# Altium schematic sheet MCU.SchDoc
size A3; SheetNumber: 2; SheetTotal: 7
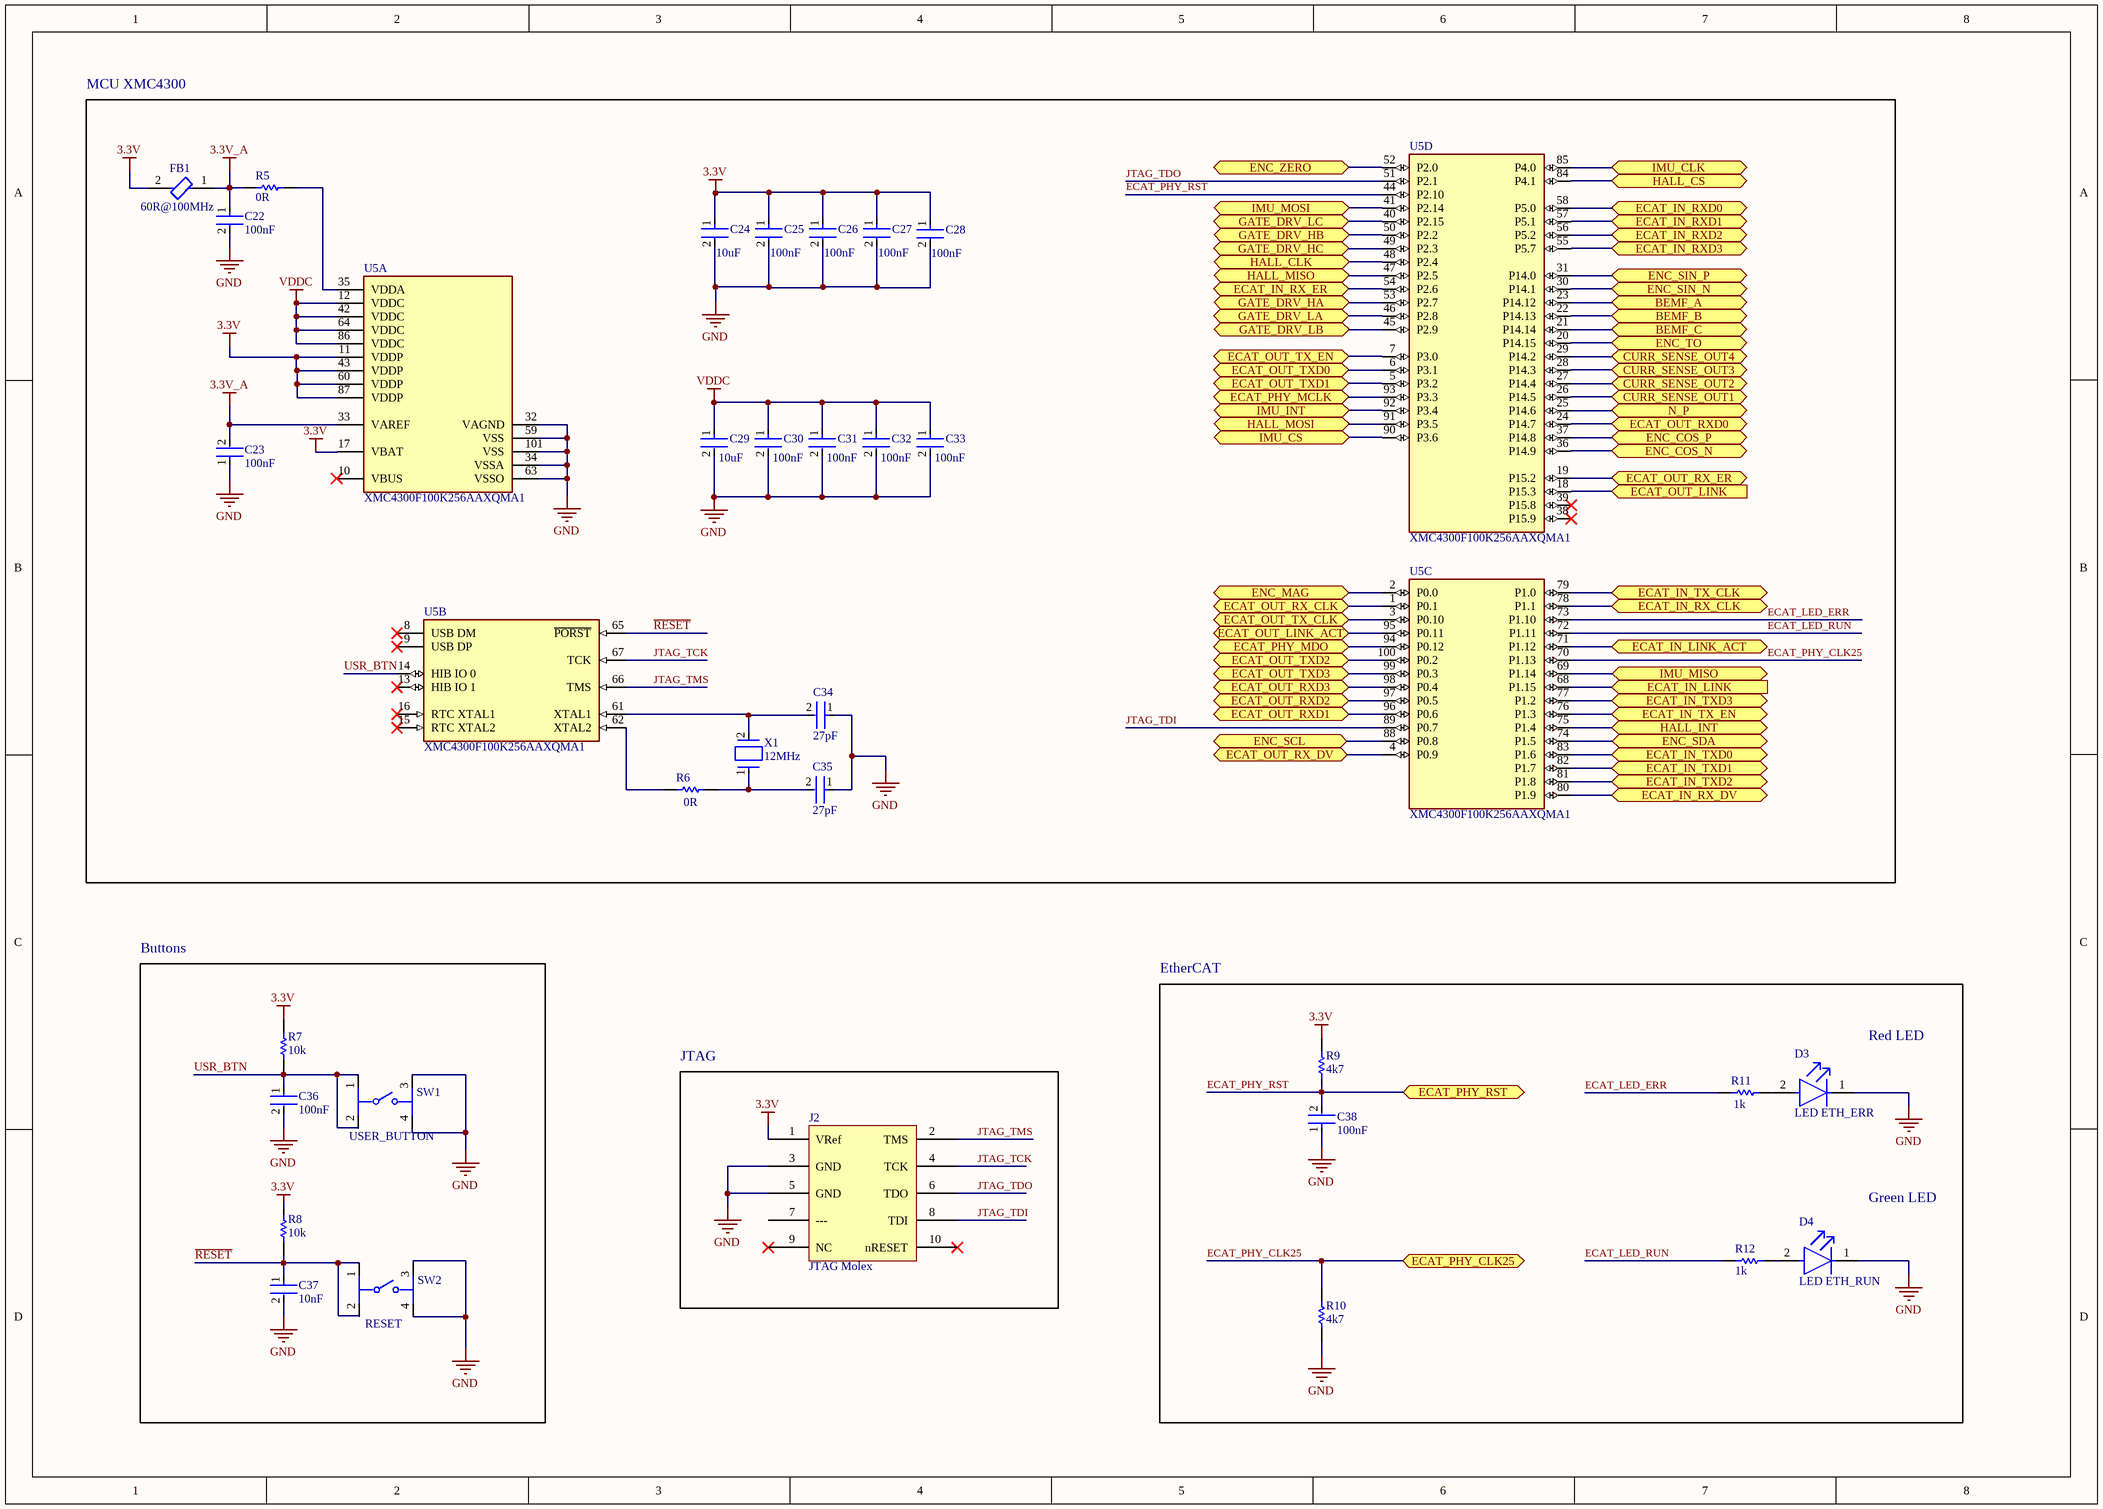
[diagram p0: MCU.SchDoc]

## Parts
C22  100nF  [FP-C0805C-DN-MFG]
C23  100nF  [FP-C0805C-DN-MFG]
C24  10uF  [FP-C0805C-DN-MFG]
C25  100nF  [FP-C0805C-DN-MFG]
C26  100nF  [FP-C0805C-DN-MFG]
C27  100nF  [FP-C0805C-DN-MFG]
C28  100nF  [FP-C0805C-DN-MFG]
C29  10uF  [FP-C0805C-DN-MFG]
C30  100nF  [FP-C0805C-DN-MFG]
C31  100nF  [FP-C0805C-DN-MFG]
C32  100nF  [FP-C0805C-DN-MFG]
C33  100nF  [FP-C0805C-DN-MFG]
C34  27pF  [FP-C0805C-DN-MFG]
C35  27pF  [FP-C0805C-DN-MFG]
C36  100nF  [FP-C0805C-DN-MFG]
C37  10nF  [FP-C0805C-DN-MFG]
C38  100nF  [FP-C0805C-DN-MFG]
D3  LED ETH_ERR  [FP-LTST-C191GKT-MFG]
D4  LED ETH_RUN  [FP-LTST-C191GKT-MFG]
FB1  60R@100MHz  [FP-BLM18-0_15-t0_8-IPC_C]
J2  JTAG Molex  [2X5_JTAG_HEADER]
R5  0R  [RESC2013X50X30LL20T20]
R6  0R  [RESC2013X50X30LL20T20]
R7  10k  [RESC2013X50X30LL20T20]
R8  10k  [RESC2013X50X30LL20T20]
R9  4k7  [RESC2013X50X30LL20T20]
R10  4k7  [RESC2013X50X30LL20T20]
R11  1k  [RESC2013X50X30LL20T20]
R12  1k  [RESC2013X50X30LL20T20]
SW1  USER_BUTTON  [FP-TL3305AF260QG-MFG]
SW2  RESET  [FP-TL3305AF260QG-MFG]
U5  XMC4300F100K256AAXQMA1  [FP-PG-LQFP-100-MFG]  (parts A,B,C,D of 4)
X1  12MHz  [FP-ABM3-MFG]

## Blocks framed on the sheet
MCU XMC4300: C22-C35 FB1 R5 R6 U5 X1
Buttons: C36 C37 R7 R8 SW1 SW2
JTAG: J2

## Ports
BEMF_A (bidir, see MOSFET[4A]), BEMF_B (bidir, see MOSFET[4B]), BEMF_C (bidir, see MOSFET[4B]), CURR_SENSE_OUT1 (bidir, see MOSFET[1C]), CURR_SENSE_OUT2 (bidir, see MOSFET[1C]), CURR_SENSE_OUT3 (bidir, see MOSFET[1C]), CURR_SENSE_OUT4 (bidir, see MOSFET[1C]), ECAT_IN_LINK (in, see ECAT0_(IN)[3D]), ECAT_IN_LINK_ACT (bidir, see ECAT0_(IN)[3D]), ECAT_IN_RX_CLK (bidir, see ECAT0_(IN)[1C]), ECAT_IN_RX_DV (bidir, see ECAT0_(IN)[1C]), ECAT_IN_RX_ER (bidir, see ECAT0_(IN)[1C]), ECAT_IN_RXD0 (bidir, see ECAT0_(IN)[4C]), ECAT_IN_RXD1 (bidir, see ECAT0_(IN)[4C]), ECAT_IN_RXD2 (bidir, see ECAT0_(IN)[4C]), ECAT_IN_RXD3 (bidir, see ECAT0_(IN)[4C]), ECAT_IN_TX_CLK (bidir, see ECAT0_(IN)[1B]), ECAT_IN_TX_EN (bidir, see ECAT0_(IN)[1B]), ECAT_IN_TXD0 (bidir, see ECAT0_(IN)[1B]), ECAT_IN_TXD1 (bidir, see ECAT0_(IN)[1B]), ECAT_IN_TXD2 (bidir, see ECAT0_(IN)[1C]), ECAT_IN_TXD3 (bidir, see ECAT0_(IN)[1C]), ECAT_OUT_LINK (in, see ECAT1_(OUT)[4D]), ECAT_OUT_LINK_ACT (bidir, see ECAT1_(OUT)[4D]), ECAT_OUT_RX_CLK (bidir, see ECAT1_(OUT)[1C]), ECAT_OUT_RX_DV (bidir, see ECAT1_(OUT)[1C]), ECAT_OUT_RX_ER (bidir, see ECAT1_(OUT)[1C]), ECAT_OUT_RXD0 (bidir, see ECAT1_(OUT)[4C]), ECAT_OUT_RXD1 (bidir, see ECAT1_(OUT)[4C]), ECAT_OUT_RXD2 (bidir, see ECAT1_(OUT)[4C]), ECAT_OUT_RXD3 (bidir, see ECAT1_(OUT)[4C]), ECAT_OUT_TX_CLK (bidir, see ECAT1_(OUT)[1B]), ECAT_OUT_TX_EN (bidir, see ECAT1_(OUT)[1C]), ECAT_OUT_TXD0 (bidir, see ECAT1_(OUT)[1C]), ECAT_OUT_TXD1 (bidir, see ECAT1_(OUT)[1C]), ECAT_OUT_TXD2 (bidir, see ECAT1_(OUT)[1C]), ECAT_OUT_TXD3 (bidir, see ECAT1_(OUT)[1C]), ECAT_PHY_CLK25 (bidir, see ECAT0_(IN)[4B], ECAT1_(OUT)[4B]), ECAT_PHY_MCLK (bidir, see ECAT0_(IN)[1C], ECAT1_(OUT)[1C]), ECAT_PHY_MDO (bidir, see ECAT0_(IN)[1C], ECAT1_(OUT)[1C]), ECAT_PHY_RST (bidir, see ECAT0_(IN)[1C], ECAT1_(OUT)[1C]), ENC_COS_N (bidir, see Encoder[3B]), ENC_COS_P (bidir, see Encoder[3C]), ENC_MAG (bidir, see Encoder[1A]), ENC_SCL (bidir, see Encoder[2A]), ENC_SDA (bidir, see Encoder[2A]), ENC_SIN_N (bidir, see Encoder[3B]), ENC_SIN_P (bidir, see Encoder[3B]), ENC_TO (bidir, see Encoder[2C]), ENC_ZERO (bidir, see Encoder[1A]), GATE_DRV_HA (bidir, see MOSFET[1A]), GATE_DRV_HB (bidir, see MOSFET[1A]), GATE_DRV_HC (bidir, see MOSFET[1A]), GATE_DRV_LA (bidir, see MOSFET[1B]), GATE_DRV_LB (bidir, see MOSFET[1B]), GATE_DRV_LC (bidir, see MOSFET[1B]), HALL_CLK (bidir, see Encoder[3A]), HALL_CS (bidir, see Encoder[3A]), HALL_INT (bidir, see Encoder[3B]), HALL_MISO (bidir, see Encoder[3A]), HALL_MOSI (bidir, see Encoder[3A]), IMU_CLK (bidir, see IMU[2B]), IMU_CS (bidir, see IMU[2B]), IMU_INT (bidir, see IMU[2B]), IMU_MISO (bidir, see IMU[2B]), IMU_MOSI (bidir, see IMU[2B]), N_P (bidir, see MOSFET[4C])

## Nets
3.3V: C24.1 C25.1 C26.1 C27.1 C28.1 FB1.2 J2.1(VRef) R7.1 R8.1 R9.2 U5.11(VDDP) U5.17(VBAT) U5.43(VDDP) U5.60(VDDP) U5.87(VDDP)
3.3V_A: C22.1 C23.2 FB1.1 R5.1 U5.33(VAREF)
GND: C22.2 C23.1 C24.2 C25.2 C26.2 C27.2 C28.2 C29.2 C30.2 C31.2 C32.2 C33.2 C34.1 C35.1 C36.2 C37.2 C38.1 D3.1(C) D4.1(C) J2.3(GND) J2.5(GND) R10.1 SW1.3 SW1.4 SW2.3 SW2.4 U5.32(VAGND) U5.34(VSSA) U5.59(VSS) U5.63(VSSO) U5.101(VSS)
VDDC: C29.1 C30.1 C31.1 C32.1 C33.1 U5.12(VDDC) U5.42(VDDC) U5.64(VDDC) U5.86(VDDC)
BEMF_A: U5.23(P14.12) ; port BEMF_A
BEMF_B: U5.22(P14.13) ; port BEMF_B
BEMF_C: U5.21(P14.14) ; port BEMF_C
CURR_SENSE_OUT1: U5.26(P14.5) ; port CURR_SENSE_OUT1
CURR_SENSE_OUT2: U5.27(P14.4) ; port CURR_SENSE_OUT2
CURR_SENSE_OUT3: U5.28(P14.3) ; port CURR_SENSE_OUT3
CURR_SENSE_OUT4: U5.29(P14.2) ; port CURR_SENSE_OUT4
ECAT_IN_LINK: U5.68(P1.15) ; port ECAT_IN_LINK
ECAT_IN_LINK_ACT: U5.71(P1.12) ; port ECAT_IN_LINK_ACT
ECAT_IN_RX_CLK: U5.78(P1.1) ; port ECAT_IN_RX_CLK
ECAT_IN_RX_DV: U5.80(P1.9) ; port ECAT_IN_RX_DV
ECAT_IN_RX_ER: U5.54(P2.6) ; port ECAT_IN_RX_ER
ECAT_IN_RXD0: U5.58(P5.0) ; port ECAT_IN_RXD0
ECAT_IN_RXD1: U5.57(P5.1) ; port ECAT_IN_RXD1
ECAT_IN_RXD2: U5.56(P5.2) ; port ECAT_IN_RXD2
ECAT_IN_RXD3: U5.55(P5.7) ; port ECAT_IN_RXD3
ECAT_IN_TX_CLK: U5.79(P1.0) ; port ECAT_IN_TX_CLK
ECAT_IN_TX_EN: U5.76(P1.3) ; port ECAT_IN_TX_EN
ECAT_IN_TXD0: U5.83(P1.6) ; port ECAT_IN_TXD0
ECAT_IN_TXD1: U5.82(P1.7) ; port ECAT_IN_TXD1
ECAT_IN_TXD2: U5.81(P1.8) ; port ECAT_IN_TXD2
ECAT_IN_TXD3: U5.77(P1.2) ; port ECAT_IN_TXD3
ECAT_LED_ERR: R11.1 U5.73(P1.10)
ECAT_LED_RUN: R12.1 U5.72(P1.11)
ECAT_OUT_LINK: U5.18(P15.3) ; port ECAT_OUT_LINK
ECAT_OUT_LINK_ACT: U5.95(P0.11) ; port ECAT_OUT_LINK_ACT
ECAT_OUT_RX_CLK: U5.1(P0.1) ; port ECAT_OUT_RX_CLK
ECAT_OUT_RX_DV: U5.4(P0.9) ; port ECAT_OUT_RX_DV
ECAT_OUT_RX_ER: U5.19(P15.2) ; port ECAT_OUT_RX_ER
ECAT_OUT_RXD0: U5.24(P14.7) ; port ECAT_OUT_RXD0
ECAT_OUT_RXD1: U5.96(P0.6) ; port ECAT_OUT_RXD1
ECAT_OUT_RXD2: U5.97(P0.5) ; port ECAT_OUT_RXD2
ECAT_OUT_RXD3: U5.98(P0.4) ; port ECAT_OUT_RXD3
ECAT_OUT_TX_CLK: U5.3(P0.10) ; port ECAT_OUT_TX_CLK
ECAT_OUT_TX_EN: U5.7(P3.0) ; port ECAT_OUT_TX_EN
ECAT_OUT_TXD0: U5.6(P3.1) ; port ECAT_OUT_TXD0
ECAT_OUT_TXD1: U5.5(P3.2) ; port ECAT_OUT_TXD1
ECAT_OUT_TXD2: U5.100(P0.2) ; port ECAT_OUT_TXD2
ECAT_OUT_TXD3: U5.99(P0.3) ; port ECAT_OUT_TXD3
ECAT_PHY_CLK25: R10.2 U5.70(P1.13) ; port ECAT_PHY_CLK25
ECAT_PHY_MCLK: U5.93(P3.3) ; port ECAT_PHY_MCLK
ECAT_PHY_MDO: U5.94(P0.12) ; port ECAT_PHY_MDO
ECAT_PHY_RST: C38.2 R9.1 U5.44(P2.10) ; port ECAT_PHY_RST
ENC_COS_N: U5.36(P14.9) ; port ENC_COS_N
ENC_COS_P: U5.37(P14.8) ; port ENC_COS_P
ENC_MAG: U5.2(P0.0) ; port ENC_MAG
ENC_SCL: U5.88(P0.8) ; port ENC_SCL
ENC_SDA: U5.74(P1.5) ; port ENC_SDA
ENC_SIN_N: U5.30(P14.1) ; port ENC_SIN_N
ENC_SIN_P: U5.31(P14.0) ; port ENC_SIN_P
ENC_TO: U5.20(P14.15) ; port ENC_TO
ENC_ZERO: U5.52(P2.0) ; port ENC_ZERO
GATE_DRV_HA: U5.53(P2.7) ; port GATE_DRV_HA
GATE_DRV_HB: U5.50(P2.2) ; port GATE_DRV_HB
GATE_DRV_HC: U5.49(P2.3) ; port GATE_DRV_HC
GATE_DRV_LA: U5.46(P2.8) ; port GATE_DRV_LA
GATE_DRV_LB: U5.45(P2.9) ; port GATE_DRV_LB
GATE_DRV_LC: U5.40(P2.15) ; port GATE_DRV_LC
HALL_CLK: U5.48(P2.4) ; port HALL_CLK
HALL_CS: U5.84(P4.1) ; port HALL_CS
HALL_INT: U5.75(P1.4) ; port HALL_INT
HALL_MISO: U5.47(P2.5) ; port HALL_MISO
HALL_MOSI: U5.91(P3.5) ; port HALL_MOSI
IMU_CLK: U5.85(P4.0) ; port IMU_CLK
IMU_CS: U5.90(P3.6) ; port IMU_CS
IMU_INT: U5.92(P3.4) ; port IMU_INT
IMU_MISO: U5.69(P1.14) ; port IMU_MISO
IMU_MOSI: U5.41(P2.14) ; port IMU_MOSI
JTAG_TCK: J2.4(TCK) U5.67(TCK)
JTAG_TDI: J2.8(TDI) U5.89(P0.7)
JTAG_TDO: J2.6(TDO) U5.51(P2.1)
JTAG_TMS: J2.2(TMS) U5.66(TMS)
N_P: U5.25(P14.6) ; port N_P
~{RESET}: C37.1 R8.2 SW2.1 SW2.2 U5.65(~{PORST})
USR_BTN: C36.1 R7.2 SW1.1 SW1.2 U5.14(HIB_IO_0)
NetC34_2: C34.2 U5.61(XTAL1) X1.2
NetC35_2: C35.2 R6.2 X1.1
NetD3_2: D3.2(A) R11.2
NetD4_2: D4.2(A) R12.2
NetR5_2: R5.2 U5.35(VDDA)
NetR6_1: R6.1 U5.62(XTAL2)

Not connected (* = marked no-connect by the designer): J2 7(---) 9(NC)* 10(nRESET)*; U5 8(USB_DM)* 9(USB_DP)* 10(VBUS)* 13(HIB_IO_1)* 15(RTC_XTAL2)* 16(RTC_XTAL1)* 38(P15.9)* 39(P15.8)*

## Notes on the sheet
- EtherCAT
- Red LED
- Green LED

## Library data of the parts
C22-C38 = CMP-2007-00279-2: CAP CER 0.1UF 50V X7R 0805; Manufacturer Part Number: C0805C104K5RACTU; Manufacturer: KEMET; Value: 0.10 μF; Tolerance: 0.1; Temperature Coefficient: 30ppm/°C; Material: Ceramic; Device Class L2: Capacitors; Temperature Range Low: -55°C; Voltage Rating: 50 V; Digikey Description: CAP CER 0.1UF 50V X7R 0805; Category: Cap; ComponentLink2Description: Datasheet; Octopart: https://octopart.com/c0805c104k5ractu-kemet-143926; RoHS: TRUE; ComponentLink2URL: https://content.kemet.com/datasheets/KEM_C1003_C0G_SMD.pdf; Temperature Characteristic: X7R; Temperature: -55°C to +125°C; Height: 0.88mm; Temperature Range High: +125°C; Device Class L1: Passive Components; Automotive: No; Lead Free: Yes; Ipc Land Pattern Name: CAPC200125X78; Device Class L3: Ceramic Capacitors; Mouser Description: Cap Ceramic 0.1uF 50V X7R 10% SMD 2.0 x 1.2 mm 125 C Paper T/R; Capacitance: 0.10 μF; Package: C0805C-DN
D3 D4 = CMP-22017-000029-1: KPHD-1608LVCGCK; Power Dissipation: 100mW; Lens Color: Colorless; Number of Elements: 1; Dominant Wavelength: 569nm; Illumination Color: Green; Lens Style: Clear; Forward Voltage: 2.1V; Forward Current: 30mA; Test Current: 20mA; Viewing Angle: 130°; Wavelength: 565nm; Luminous Intensity: 12mcd; Reverse Voltage: 5V; Case/Package: 0603; Package Quantity: 1; Lens Transparency: Clear; Depth: 0.8mm; Power Rating: 100mW; Width: 0.8mm; Height: 0.55mm; Radiation Hardening: No; Case Code (Imperial): 0603; Number of Pins: 2; Length: 1.6mm; Case Code (Metric): 1608; Max Operating Temperature: 85°C; Color: Green; Packaging: Tape and Reel; Mount: Surface Mount; Min Operating Temperature: -55°C; Lead Free: Lead Free; Number of LEDs: 1
FB1 = CMP-06046-002563-1: Chip Ferrite Bead, 0603, 60Ω @ 100MHz, 0.1Ω, , 1A / BLM18PG600SH1D; Max Current Rating: 500mA; Impedance: 60R; DC Resistance (DCR): 100mR; Number of Circuits: 1; Material: Steel; Tolerance: 25%; Shielding: Unshielded; Ratings: AEC-Q200; Height: 0.8mm; Mount: Surface Mount; RoHS Compliant: Yes; Case Code (Metric): 1608; Package Quantity: 4000; Length: 1.6mm; REACH SVHC: No SVHC; Width: 0.8mm; Number of Lines: 1; Contact Plating: Tin; Min Operating Temperature: -55°C; Packaging: Tape and Reel; Series: EMIFIL®, BLM18P; Case/Package: 0603; Max DC Current: 500mA; Case Code (Imperial): 0603; Termination: SMD/SMT; Current Rating: 500mA; Max Operating Temperature: 125°C; Test Frequency: 100MHz
J2 = 5x2_1,27mm_JTAG: MOLEX for JTAG, 5x2, 1,27 mm
R5-R8 = CMP-2001-04896-1: Manufacturer: Vishay Dale; Part Number: CRCW08050000Z0EA
R9-R12 = CMP-2001-04896-1: 0805; Manufacturer: Vishay Dale; Part Number: CRCW08050000Z0EA
SW1 SW2 = CMP-17879-000010-1: SWITCH TACTILE SPST-NO 50MA 12V / TL3305AF260QG; Mechanical Life: 200000Cycles; Switch Function: Off-Mom; Actuator Type: Standard; Operating Force: 260gf; Illumination Type: Non-Illuminated; Switch Travel: 0.2mm; Throw Configuration: SPST; Min Operating Temperature: -20°C; Max Operating Temperature: 70°C; Lead Free: Lead Free; Mount: Surface Mount; Packaging: Tape and Reel; Termination: Gull Wing
U5 = CMP-32808-000041-1: IC MCU 32BIT 256KB FLASH 100LQFP; RoHS Compliant: Yes
X1 = CMP-27762-007917-1: Crystal 12MHz SMD-2 5mm x 3.2mm; ESR (Equivalent Series Resistance): 60R; Load Capacitance: 18pF; Tolerance: 20ppm; Frequency Stability: 30ppm; Depth: 3.2mm; Length: 5mm; Height: 0.051inch; Case/Package: CSMD; Package Quantity: 1000; Frequency: 12MHz; Packaging: Tape and Reel; Min Operating Temperature: -40°C; Operating Frequency: 12 MHz; Number of Pins: 2; Termination: SMD/SMT; Mount: Surface Mount; Width: 0.126inch; Resistor Type: Ceramic; Frequency Tolerance: 20ppm; Lead Free: Lead Free; Max Operating Temperature: 85°C; Radiation Hardening: No; Series Resistance: 60R; Series: ABM3